# EAGLE design LuMini_3Inch (EAGLE 9.1.0)
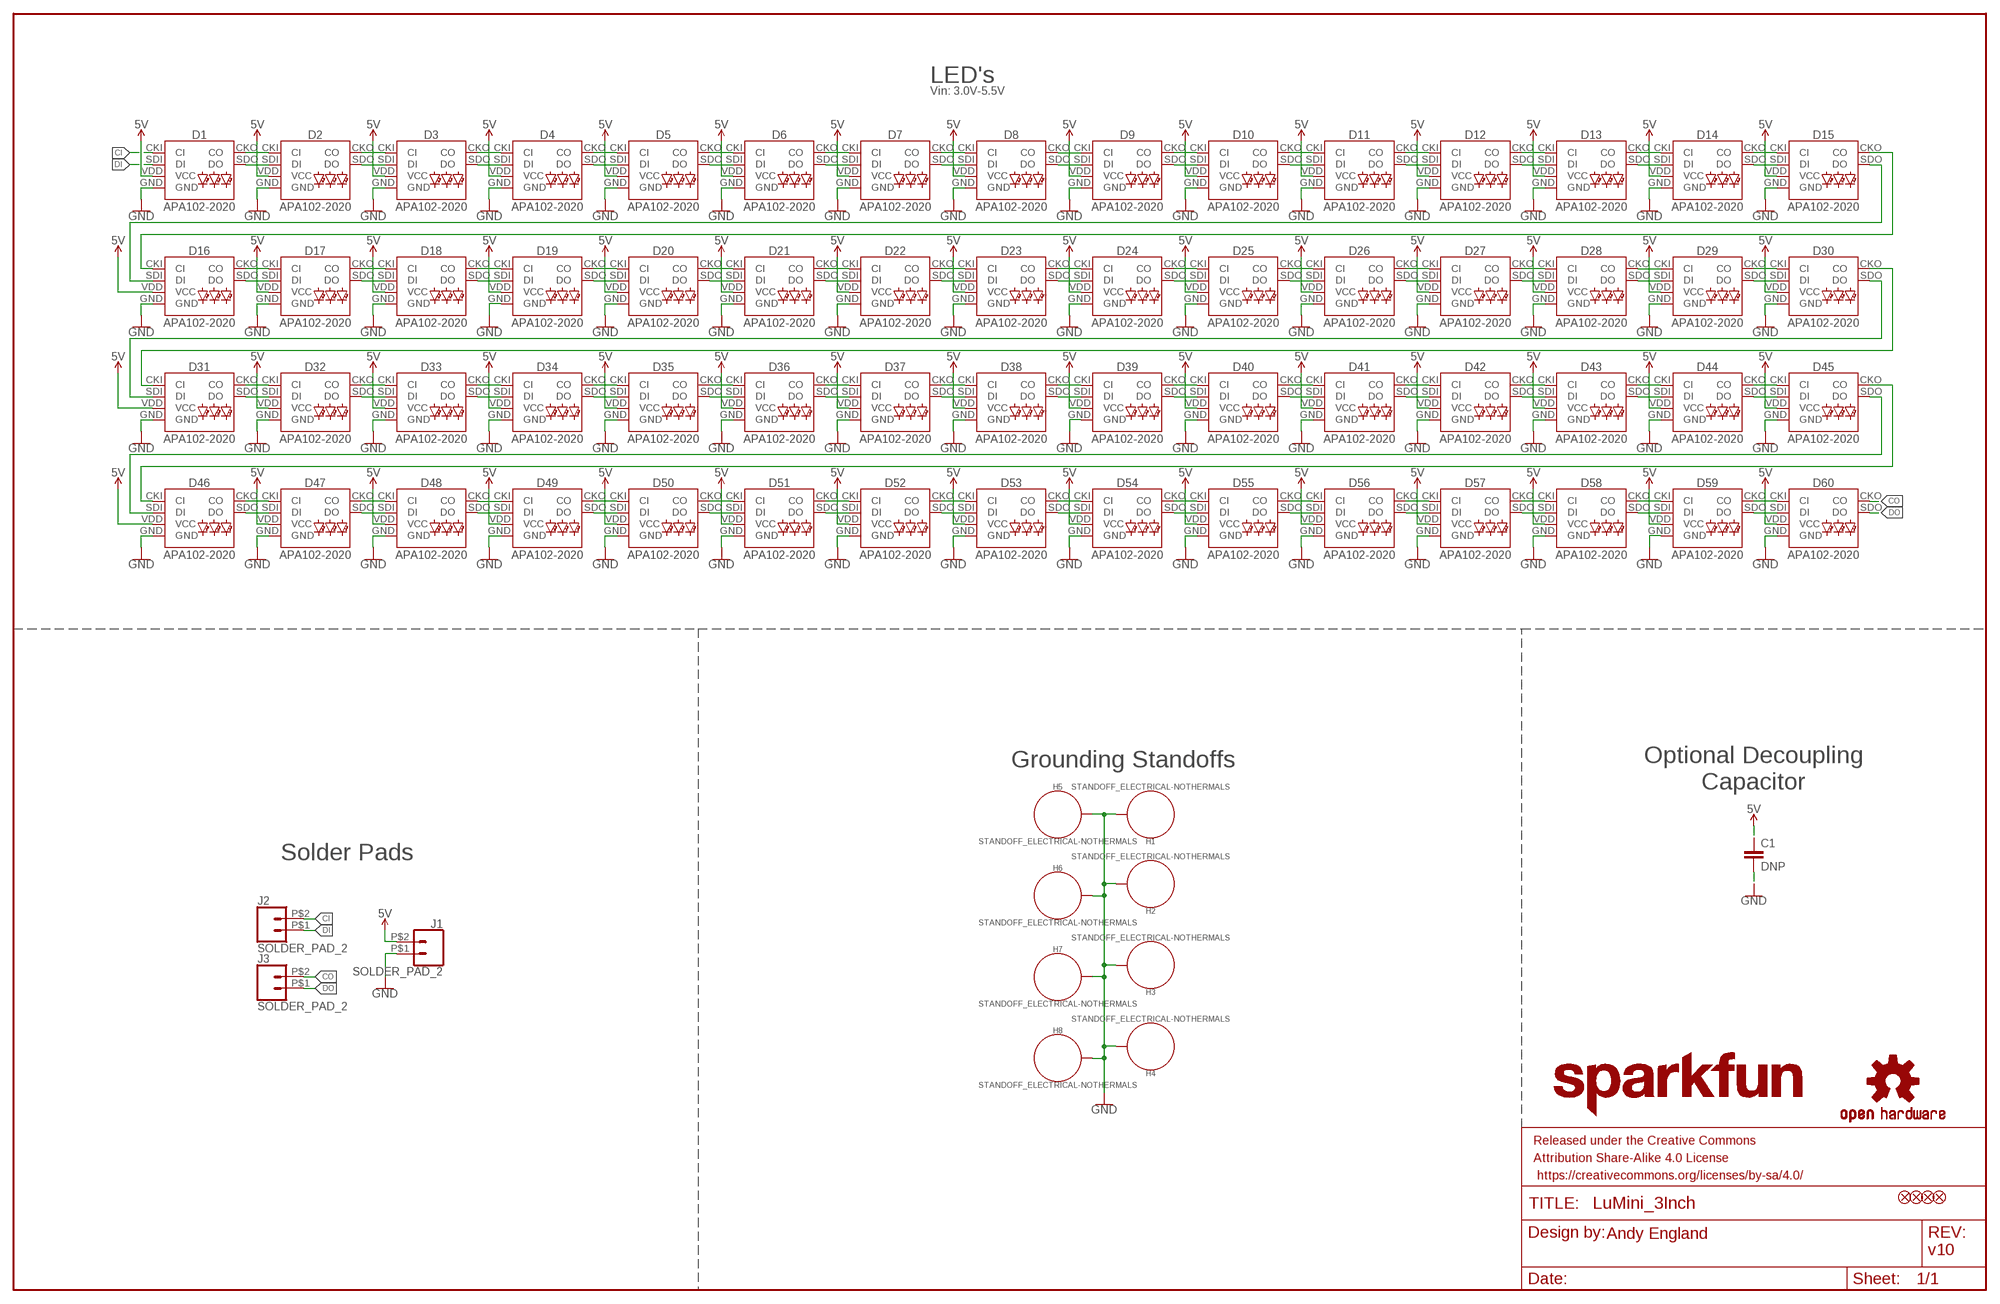
[diagram p0: schematic, sheet 1]

## Parts
C1  DNP  4.7UF-1206-16V-(+80/-20%)  [1206]
D1  APA102-2020  [APA102-2020]
D2  APA102-2020  [APA102-2020]
D3  APA102-2020  [APA102-2020]
D4  APA102-2020  [APA102-2020]
D5  APA102-2020  [APA102-2020]
D6  APA102-2020  [APA102-2020]
D7  APA102-2020  [APA102-2020]
D8  APA102-2020  [APA102-2020]
D9  APA102-2020  [APA102-2020]
D10  APA102-2020  [APA102-2020]
D11  APA102-2020  [APA102-2020]
D12  APA102-2020  [APA102-2020]
D13  APA102-2020  [APA102-2020]
D14  APA102-2020  [APA102-2020]
D15  APA102-2020  [APA102-2020]
D16  APA102-2020  [APA102-2020]
D17  APA102-2020  [APA102-2020]
D18  APA102-2020  [APA102-2020]
D19  APA102-2020  [APA102-2020]
D20  APA102-2020  [APA102-2020]
D21  APA102-2020  [APA102-2020]
D22  APA102-2020  [APA102-2020]
D23  APA102-2020  [APA102-2020]
D24  APA102-2020  [APA102-2020]
D25  APA102-2020  [APA102-2020]
D26  APA102-2020  [APA102-2020]
D27  APA102-2020  [APA102-2020]
D28  APA102-2020  [APA102-2020]
D29  APA102-2020  [APA102-2020]
D30  APA102-2020  [APA102-2020]
D31  APA102-2020  [APA102-2020]
D32  APA102-2020  [APA102-2020]
D33  APA102-2020  [APA102-2020]
D34  APA102-2020  [APA102-2020]
D35  APA102-2020  [APA102-2020]
D36  APA102-2020  [APA102-2020]
D37  APA102-2020  [APA102-2020]
D38  APA102-2020  [APA102-2020]
D39  APA102-2020  [APA102-2020]
D40  APA102-2020  [APA102-2020]
D41  APA102-2020  [APA102-2020]
D42  APA102-2020  [APA102-2020]
D43  APA102-2020  [APA102-2020]
D44  APA102-2020  [APA102-2020]
D45  APA102-2020  [APA102-2020]
D46  APA102-2020  [APA102-2020]
D47  APA102-2020  [APA102-2020]
D48  APA102-2020  [APA102-2020]
D49  APA102-2020  [APA102-2020]
D50  APA102-2020  [APA102-2020]
D51  APA102-2020  [APA102-2020]
D52  APA102-2020  [APA102-2020]
D53  APA102-2020  [APA102-2020]
D54  APA102-2020  [APA102-2020]
D55  APA102-2020  [APA102-2020]
D56  APA102-2020  [APA102-2020]
D57  APA102-2020  [APA102-2020]
D58  APA102-2020  [APA102-2020]
D59  APA102-2020  [APA102-2020]
D60  APA102-2020  [APA102-2020]
FD1  FIDUCIALUFIDUCIAL  [FIDUCIAL-MICRO]
FD2  FIDUCIALUFIDUCIAL  [FIDUCIAL-MICRO]
FD3  FIDUCIALUFIDUCIAL  [FIDUCIAL-MICRO]
FD4  FIDUCIALUFIDUCIAL  [FIDUCIAL-MICRO]
FRAME1  FRAME-LEDGER  [CREATIVE_COMMONS]
H1  STANDOFF_ELECTRICAL-NOTHERMALS  [STANDOFF-ELECTRICAL-NOTHERMALS]
H2  STANDOFF_ELECTRICAL-NOTHERMALS  [STANDOFF-ELECTRICAL-NOTHERMALS]
H3  STANDOFF_ELECTRICAL-NOTHERMALS  [STANDOFF-ELECTRICAL-NOTHERMALS]
H4  STANDOFF_ELECTRICAL-NOTHERMALS  [STANDOFF-ELECTRICAL-NOTHERMALS]
H5  STANDOFF_ELECTRICAL-NOTHERMALS  [STANDOFF-ELECTRICAL-NOTHERMALS]
H6  STANDOFF_ELECTRICAL-NOTHERMALS  [STANDOFF-ELECTRICAL-NOTHERMALS]
H7  STANDOFF_ELECTRICAL-NOTHERMALS  [STANDOFF-ELECTRICAL-NOTHERMALS]
H8  STANDOFF_ELECTRICAL-NOTHERMALS  [STANDOFF-ELECTRICAL-NOTHERMALS]
J1  SOLDER_PAD_2  [SOLDER_PAD_2]
J2  SOLDER_PAD_2  [SOLDER_PAD_2]
J3  SOLDER_PAD_2  [SOLDER_PAD_2]
LOGO1  OSHW-LOGOS  [OSHW-LOGO-S]
LOGO2  SFE_LOGO_NAME.1_INCH  [SFE_LOGO_NAME_.1]

## Nets
5V: C1.1 D1.VDD(VCC) D2.VDD(VCC) D3.VDD(VCC) D4.VDD(VCC) D5.VDD(VCC) D6.VDD(VCC) D7.VDD(VCC) D8.VDD(VCC) D9.VDD(VCC) D10.VDD(VCC) D11.VDD(VCC) D12.VDD(VCC) D13.VDD(VCC) D14.VDD(VCC) D15.VDD(VCC) D16.VDD(VCC) D17.VDD(VCC) D18.VDD(VCC) D19.VDD(VCC) D20.VDD(VCC) D21.VDD(VCC) D22.VDD(VCC) D23.VDD(VCC) D24.VDD(VCC) D25.VDD(VCC) D26.VDD(VCC) D27.VDD(VCC) D28.VDD(VCC) D29.VDD(VCC) D30.VDD(VCC) D31.VDD(VCC) D32.VDD(VCC) D33.VDD(VCC) D34.VDD(VCC) D35.VDD(VCC) D36.VDD(VCC) D37.VDD(VCC) D38.VDD(VCC) D39.VDD(VCC) D40.VDD(VCC) D41.VDD(VCC) D42.VDD(VCC) D43.VDD(VCC) D44.VDD(VCC) D45.VDD(VCC) D46.VDD(VCC) D47.VDD(VCC) D48.VDD(VCC) D49.VDD(VCC) D50.VDD(VCC) D51.VDD(VCC) D52.VDD(VCC) D53.VDD(VCC) D54.VDD(VCC) D55.VDD(VCC) D56.VDD(VCC) D57.VDD(VCC) D58.VDD(VCC) D59.VDD(VCC) D60.VDD(VCC) J1.P$2
CI: D1.CKI(CI) J2.P$2
CO: D60.CKO(CO) J3.P$2
DI: D1.SDI(DI) J2.P$1
DO: D60.SDO(DO) J3.P$1
GND: C1.2 D1.GND D2.GND D3.GND D4.GND D5.GND D6.GND D7.GND D8.GND D9.GND D10.GND D11.GND D12.GND D13.GND D14.GND D15.GND D16.GND D17.GND D18.GND D19.GND D20.GND D21.GND D22.GND D23.GND D24.GND D25.GND D26.GND D27.GND D28.GND D29.GND D30.GND D31.GND D32.GND D33.GND D34.GND D35.GND D36.GND D37.GND D38.GND D39.GND D40.GND D41.GND D42.GND D43.GND D44.GND D45.GND D46.GND D47.GND D48.GND D49.GND D50.GND D51.GND D52.GND D53.GND D54.GND D55.GND D56.GND D57.GND D58.GND D59.GND D60.GND H1.P1 H2.P1 H3.P1 H4.P1 H5.P1 H6.P1 H7.P1 H8.P1 J1.P$1
N$1: D4.CKO(CO) D5.CKI(CI)
N$4: D1.CKO(CO) D2.CKI(CI)
N$5: D1.SDO(DO) D2.SDI(DI)
N$6: D2.CKO(CO) D3.CKI(CI)
N$7: D2.SDO(DO) D3.SDI(DI)
N$8: D3.CKO(CO) D4.CKI(CI)
N$9: D3.SDO(DO) D4.SDI(DI)
N$10: D4.SDO(DO) D5.SDI(DI)
N$11: D5.CKO(CO) D6.CKI(CI)
N$12: D5.SDO(DO) D6.SDI(DI)
N$13: D6.CKO(CO) D7.CKI(CI)
N$14: D6.SDO(DO) D7.SDI(DI)
N$15: D7.CKO(CO) D8.CKI(CI)
N$16: D7.SDO(DO) D8.SDI(DI)
N$17: D16.SDO(DO) D17.SDI(DI)
N$18: D20.SDO(DO) D21.SDI(DI)
N$19: D9.CKO(CO) D10.CKI(CI)
N$20: D9.SDO(DO) D10.SDI(DI)
N$21: D10.CKO(CO) D11.CKI(CI)
N$22: D10.SDO(DO) D11.SDI(DI)
N$23: D11.CKO(CO) D12.CKI(CI)
N$24: D11.SDO(DO) D12.SDI(DI)
N$25: D12.CKO(CO) D13.CKI(CI)
N$26: D12.SDO(DO) D13.SDI(DI)
N$27: D13.CKO(CO) D14.CKI(CI)
N$28: D13.SDO(DO) D14.SDI(DI)
N$29: D14.CKO(CO) D15.CKI(CI)
N$30: D14.SDO(DO) D15.SDI(DI)
N$31: D45.CKO(CO) D46.CKI(CI)
N$32: D30.CKO(CO) D31.CKI(CI)
N$33: D8.CKO(CO) D9.CKI(CI)
N$34: D8.SDO(DO) D9.SDI(DI)
N$35: D17.CKO(CO) D18.CKI(CI)
N$36: D17.SDO(DO) D18.SDI(DI)
N$37: D18.CKO(CO) D19.CKI(CI)
N$38: D18.SDO(DO) D19.SDI(DI)
N$39: D19.CKO(CO) D20.CKI(CI)
N$40: D19.SDO(DO) D20.SDI(DI)
N$41: D30.SDO(DO) D31.SDI(DI)
N$42: D15.CKO(CO) D16.CKI(CI)
N$43: D16.CKO(CO) D17.CKI(CI)
N$44: D21.CKO(CO) D22.CKI(CI)
N$45: D21.SDO(DO) D22.SDI(DI)
N$46: D22.CKO(CO) D23.CKI(CI)
N$47: D22.SDO(DO) D23.SDI(DI)
N$48: D23.CKO(CO) D24.CKI(CI)
N$49: D23.SDO(DO) D24.SDI(DI)
N$50: D24.CKO(CO) D25.CKI(CI)
N$51: D24.SDO(DO) D25.SDI(DI)
N$52: D25.CKO(CO) D26.CKI(CI)
N$53: D25.SDO(DO) D26.SDI(DI)
N$54: D26.CKO(CO) D27.CKI(CI)
N$55: D26.SDO(DO) D27.SDI(DI)
N$56: D27.CKO(CO) D28.CKI(CI)
N$57: D27.SDO(DO) D28.SDI(DI)
N$58: D29.CKO(CO) D30.CKI(CI)
N$59: D29.SDO(DO) D30.SDI(DI)
N$60: D15.SDO(DO) D16.SDI(DI)
N$61: D45.SDO(DO) D46.SDI(DI)
N$62: D31.CKO(CO) D32.CKI(CI)
N$63: D31.SDO(DO) D32.SDI(DI)
N$64: D32.CKO(CO) D33.CKI(CI)
N$65: D32.SDO(DO) D33.SDI(DI)
N$66: D33.CKO(CO) D34.CKI(CI)
N$67: D33.SDO(DO) D34.SDI(DI)
N$68: D34.CKO(CO) D35.CKI(CI)
N$69: D34.SDO(DO) D35.SDI(DI)
N$70: D35.CKO(CO) D36.CKI(CI)
N$71: D35.SDO(DO) D36.SDI(DI)
N$72: D37.CKO(CO) D38.CKI(CI)
N$73: D37.SDO(DO) D38.SDI(DI)
N$74: D38.SDO(DO) D39.SDI(DI)
N$75: D39.CKO(CO) D40.CKI(CI)
N$76: D39.SDO(DO) D40.SDI(DI)
N$77: D38.CKO(CO) D39.CKI(CI)
N$78: D28.CKO(CO) D29.CKI(CI)
N$79: D28.SDO(DO) D29.SDI(DI)
N$80: D36.SDO(DO) D37.SDI(DI)
N$81: D36.CKO(CO) D37.CKI(CI)
N$82: D40.CKO(CO) D41.CKI(CI)
N$83: D40.SDO(DO) D41.SDI(DI)
N$84: D41.CKO(CO) D42.CKI(CI)
N$85: D41.SDO(DO) D42.SDI(DI)
N$86: D42.CKO(CO) D43.CKI(CI)
N$87: D42.SDO(DO) D43.SDI(DI)
N$88: D43.CKO(CO) D44.CKI(CI)
N$89: D43.SDO(DO) D44.SDI(DI)
N$90: D44.CKO(CO) D45.CKI(CI)
N$91: D44.SDO(DO) D45.SDI(DI)
N$94: D46.CKO(CO) D47.CKI(CI)
N$95: D46.SDO(DO) D47.SDI(DI)
N$96: D47.CKO(CO) D48.CKI(CI)
N$97: D47.SDO(DO) D48.SDI(DI)
N$98: D49.CKO(CO) D50.CKI(CI)
N$99: D49.SDO(DO) D50.SDI(DI)
N$100: D50.CKO(CO) D51.CKI(CI)
N$101: D50.SDO(DO) D51.SDI(DI)
N$102: D51.CKO(CO) D52.CKI(CI)
N$103: D51.SDO(DO) D52.SDI(DI)
N$104: D52.CKO(CO) D53.CKI(CI)
N$105: D52.SDO(DO) D53.SDI(DI)
N$106: D53.CKO(CO) D54.CKI(CI)
N$107: D53.SDO(DO) D54.SDI(DI)
N$108: D54.CKO(CO) D55.CKI(CI)
N$109: D54.SDO(DO) D55.SDI(DI)
N$110: D55.CKO(CO) D56.CKI(CI)
N$111: D55.SDO(DO) D56.SDI(DI)
N$112: D57.CKO(CO) D58.CKI(CI)
N$113: D57.SDO(DO) D58.SDI(DI)
N$114: D58.SDO(DO) D59.SDI(DI)
N$115: D59.CKO(CO) D60.CKI(CI)
N$116: D59.SDO(DO) D60.SDI(DI)
N$117: D58.CKO(CO) D59.CKI(CI)
N$118: D48.CKO(CO) D49.CKI(CI)
N$119: D48.SDO(DO) D49.SDI(DI)
N$120: D56.SDO(DO) D57.SDI(DI)
N$121: D56.CKO(CO) D57.CKI(CI)
N$124: D20.CKO(CO) D21.CKI(CI)

## Notes on the sheet
- LED's
- Vin: 3.0V-5.5V
- Grounding Standoffs
- Optional Decoupling
  Capacitor
- Solder Pads
- Andy England
- v10

## Library data of the parts
C1 = SparkFun-Capacitors:4.7UF: 4.7µF ceramic capacitors A capacitor is a passive two-terminal electrical component used to store electrical energy temporarily in an electric field.; PROD_ID: CAP-10300; VALUE: 4.7uF
D1-D60 = SparkFun-LED:APA102: APA102 Addressable RGB LED Used in manufacturing of various products at SparkFun Packages: 5050 2020 SparkFun Products: SparkFun Lumenati Boards <https://www.sparkfun.com/categories/405>; PROD_ID: DIO-13883
FD1-FD4 = SparkFun-Aesthetics:FIDUCIAL: Fiducial Alignment Points Point-of-reference for pick-and-place machines and other optical instruments.
FRAME1 = SparkFun-Aesthetics:FRAME-LEDGER: Schematic Frame - Ledger Standard 11x14 US Ledger frame
H1-H8 = SparkFun-Hardware:STANDOFF_ELECTRICAL: Stand Off Drill holes with an electrical connection. For example, use these to ground your board to a chassis. Example SparkFun Products Screw - Phillips Head (1/4", 4-40, 10 pack) <https://www.sparkfun.com/products/10453> (PRT-10453) Screw - Phillips Head (1/2", 4-40, 10 pack) <https://www.sparkfun.com/products/10452> (PRT-10452) Screw - Phillips Head (3/4", 4-40, 10 pack) <https://www.sparkfun.com/products/10451> (PRT-10451) Screw - Phillips Head (1", 4-40, 10 pack) <https://www.sparkfun.com/products/10450> (PRT-10450)
J1-J3 = SparkFun-Connectors:SOLDER_PAD_2: Solder Pad for LuMini Rings
LOGO1 = SparkFun-Aesthetics:OSHW-LOGO: Open-Source Hardware (OSHW) Logo This logo indicates the piece of hardware it is found on incorporates a OSHW license and/or adheres to the definition of open source hardware found here: http://freedomdefined.org/OSHW
LOGO2 = SparkFun-Aesthetics:SFE_LOGO_NAME: SparkFun Font Logo This is the SparkFun name logo. The logo on the schematic will always be the same size; the package variant is the height of the flame part of the logo (or the height the flame would be, if it were drawn). Default layer for the logo on the board is tSilk.

## Board
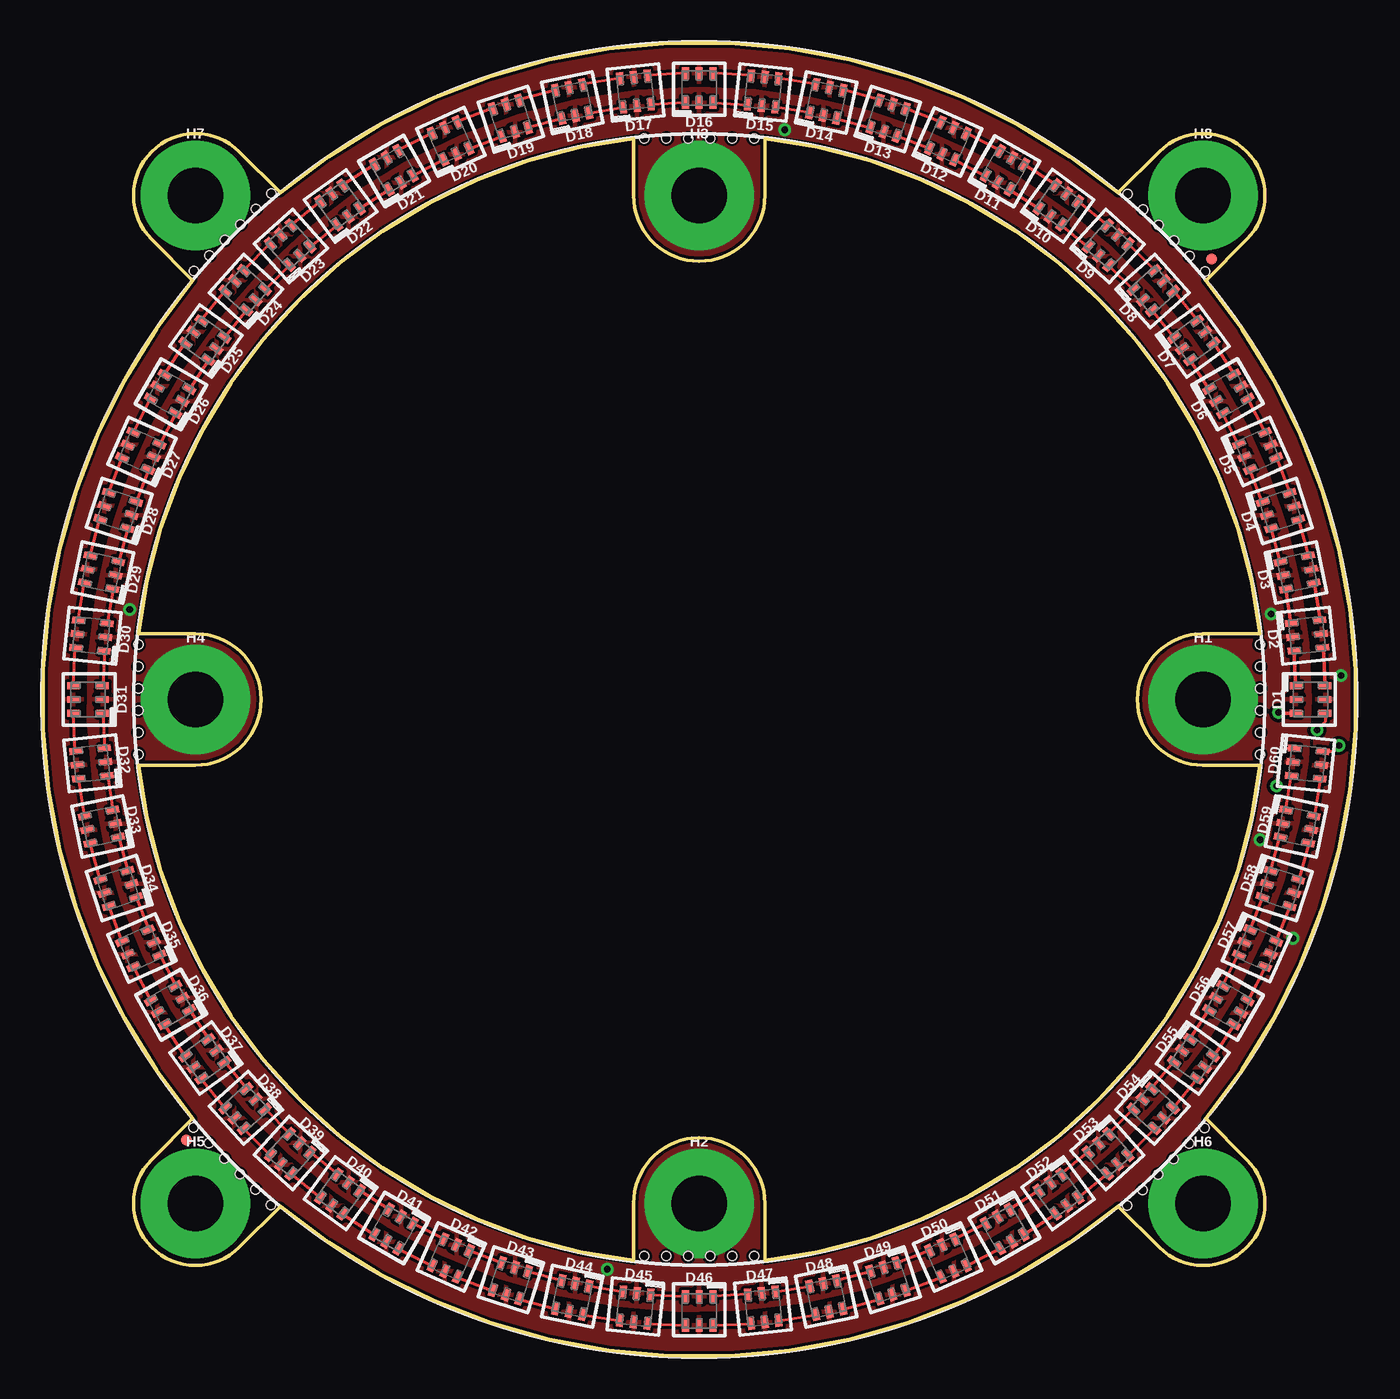
[diagram p1: board, top side]
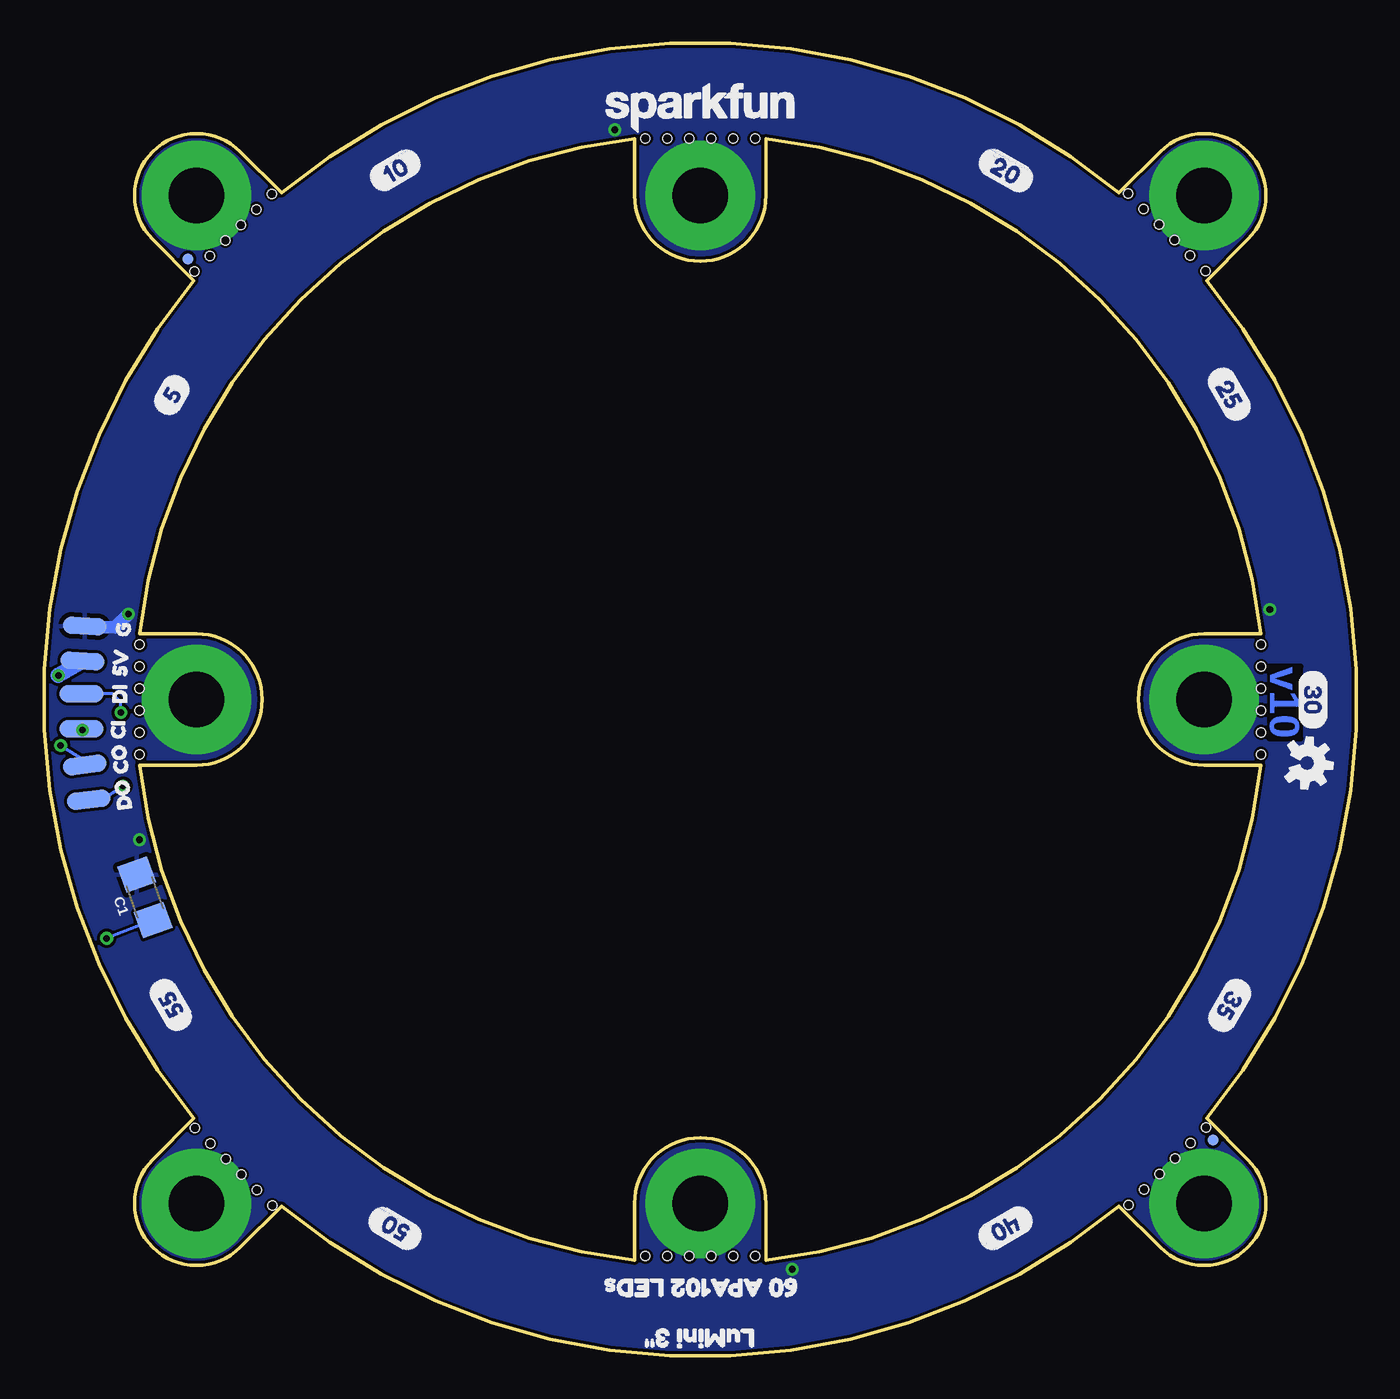
[diagram p2: board, bottom side, seen from below]

Size 76.08 x 76.08 mm. Coordinates in mm from the lower left corner, seen from the top.
Outline: 5.53,41.85 8.83,41.85 arc-90 12.64,38.04 arc-90 8.83,34.23 5.53,34.23 arc77 34.23,5.53 34.23,8.83 arc-90 38.04,12.64 arc-90 41.85,8.83 41.85,5.53 arc77 70.55,34.23 67.25,34.23 arc-90 63.44,38.04 arc-90 67.25,41.85 70.55,41.85 arc77 41.85,70.55 41.85,67.25 arc-90 38.04,63.44 arc-90 34.23,67.25 34.23,70.55 arc77 5.53,41.85
Outline: 8.68,62.32 6.29,64.71 arc-180 11.37,69.79 13.76,67.4 arc-79 62.32,67.4 64.71,69.79 arc-180 69.79,64.71 67.4,62.32 arc-79 67.4,13.76 69.79,11.37 arc-180 64.71,6.29 62.32,8.68 arc-79 13.76,8.68 11.37,6.29 arc-180 6.29,11.37 8.68,13.76 arc-79 8.68,62.32
Copper layers (1*16): Top 0.035mm / dielectric 1.5mm / Bottom 0.035mm
Design rules "SparkFun-2-layer-TIGHT": minimum track width 7mil, minimum drill 15mil, track to track 7mil, track to pad 7mil, pad to pad 7mil, via to via 7mil, smd to smd 7mil, copper to edge 7mil, drill to drill 7mil, minimum pad ring 7mil, minimum via ring 7mil, stop-mask expansion 4mil, vias tented up to drill 25mil, thermal gap 10mil
Holes 0.51 mm at 5.53,38.68 5.53,39.95 5.53,37.41 5.53,36.14 5.53,34.87 5.53,41.22 38.68,5.78 39.95,5.78 37.41,5.78 36.14,5.78 34.87,5.78 41.22,5.78 70.55,37.41 70.55,36.14 70.55,38.68 70.55,39.95 70.55,41.22 70.55,34.87 38.68,70.55 39.95,70.55 37.41,70.55 36.14,70.55 34.87,70.55 41.22,70.55 10.51,11.43 9.61,12.32 11.41,10.53 12.31,9.63 13.2,8.73 8.71,13.22 64.66,10.51 63.76,9.61 65.55,11.41 66.45,12.31 67.35,13.2 62.86,8.71 65.57,64.66 66.47,63.76 64.67,65.55 63.78,66.45 62.88,67.35 67.37,62.86 11.43,65.57 12.32,66.47 10.53,64.67 9.63,63.78 8.73,62.88 13.22,67.37

### Footprints (pad centres in the part's own frame; a part is rotated, then mirrored left to right if it is on the bottom)
1206 = smd 1.6 x 1.8: 1 -1.4,0; 2 1.4,0
APA102-2020 = smd 0.4 x 0.7: CKI -0.8,-0.85; CKO 0.8,-0.85; GND 0,0.85; SDI -0.8,0.85; SDO 0.8,0.85; VDD 0,-0.85
FIDUCIAL-MICRO = smd 0.635 x 0.635: 1 0,0
STANDOFF-ELECTRICAL-NOTHERMALS = drill 3.2 pad 6.35: P1 0,0
SOLDER_PAD_2 = smd 1.016 x 2.54: P$1 -1.016,0; P$2 1.016,0

### Placement (x,y rotation side)
C1  70.23,26.57 110 bottom
D1  73.47,38.04 90 top
D2  73.28,41.75 96 top
D3  72.7,45.41 102 top
D4  71.74,48.98 108 top
D5  70.41,52.45 114 top
D6  68.72,55.76 120 top
D7  66.71,58.86 126 top
D8  64.37,61.75 132 top
D9  61.75,64.36 138 top
D10  58.87,66.71 144 top
D11  55.76,68.72 150 top
D12  52.45,70.41 156 top
D13  48.99,71.74 162 top
D14  45.41,72.7 168 top
D15  41.75,73.28 174 top
D16  38.04,73.48 180 top
D17  34.33,73.28 186 top
D18  30.67,72.7 192 top
D19  27.1,71.73 198 top
D20  23.62,70.42 204 top
D21  20.33,68.72 210 top
D22  17.21,66.7 216 top
D23  14.32,64.37 222 top
D24  11.71,61.76 228 top
D25  9.38,58.86 234 top
D26  7.36,55.76 240 top
D27  5.67,52.45 246 top
D28  4.35,48.99 252 top
D29  3.39,45.41 258 top
D30  2.8,41.75 264 top
D31  2.6,38.04 270 top
D32  2.8,34.34 276 top
D33  3.38,30.67 282 top
D34  4.35,27.09 288 top
D35  5.67,23.62 294 top
D36  7.36,20.33 300 top
D37  9.38,17.21 306 top
D38  11.71,14.33 312 top
D39  14.32,11.72 318 top
D40  17.21,9.37 324 top
D41  20.32,7.35 330 top
D42  23.63,5.67 336 top
D43  27.1,4.34 342 top
D44  30.67,3.38 348 top
D45  34.33,2.79 354 top
D46  38.04,2.61 0 top
D47  41.75,2.8 6 top
D48  45.4,3.38 12 top
D49  48.98,4.35 18 top
D50  52.46,5.67 24 top
D51  55.76,7.36 30 top
D52  58.87,9.37 36 top
D53  61.75,11.71 42 top
D54  64.36,14.33 48 top
D55  66.71,17.21 54 top
D56  68.72,20.32 60 top
D57  70.41,23.63 66 top
D58  71.73,27.09 72 top
D59  72.7,30.68 78 top
D60  73.29,34.33 84 top
FD1  8.32,12.51 0 top
FD2  8.32,12.51 90 bottom
FD3  67.76,63.57 0 top
FD4  67.76,63.57 0 bottom
FRAME1  20.26,-8.19 0 top  (outside the outline)
H1  67.25,38.04 0 top
H2  38.04,8.83 0 top
H3  38.04,67.25 0 top
H4  8.83,38.04 0 top
H5  8.83,8.83 0 top
H6  67.25,8.83 0 top
H7  8.83,67.25 0 top
H8  67.25,67.25 0 top
J1  73.79,41.28 266.4 bottom
J2  73.92,37.35 270 bottom
J3  73.61,33.24 97 bottom
LOGO1  2.86,34.36 264 bottom
LOGO2  38.04,72.33 0 bottom
U$1  [LUMINI_3#2]  33.98,1.02 180 bottom
U$2  [60_APA102_LEDS0]  31.5,3.94 180 bottom
U$3  [54]  69.41,54.42 60 bottom
U$4  [5V6]  71.76,38.68 86.4 bottom
U$5  [G4]  71.57,40.96 86.4 bottom
U$6  [105]  57.13,67.9 30 bottom
U$7  [DO3]  71.31,30.93 97 bottom
U$8  [CO1]  71.5,33.02 97 bottom
U$9  [CI6]  71.8,35.02 90 bottom
U$10  [DI4]  71.7,37.09 90 bottom
U$11  [207]  21.86,69.59 330 bottom
U$12  [258]  8.23,57.24 300 bottom
U$13  [309]  2.52,39.81 270 bottom
U$14  [3510]  6.49,21.78 240 bottom
U$15  [4011]  18.8,8.28 210 bottom
U$16  [5013]  54.09,6.43 150 bottom
U$17  [5514]  67.91,18.9 120 bottom
U$18  [ORDERING_INSTRUCTIONS]  -9.71,-11.24 0 top  (outside the outline)

### Tracks (layer width: path | path; a pad name or v marks a point on that pad's centre or on a via)
5V  (via drill 0.38)
  Bottom 0.178: C1.1 v72.46,24.2
  Bottom 0.889: v75.25,39.44 J1.P$2
  pour Top (isolate 0.178, rank 2): 38.04,76.14 arc-90 76.14,38.04 arc-270
CI  (via drill 0.38)
  Top 0.178: D1.CKI 74.32,36.74 v73.85,36.28
  Bottom 0.178: J2.P$2 v73.85,36.28
CO  (via drill 0.38)
  Top 0.178: v75.12,35.37 74.79,35.04 D60.CKO
  Bottom 0.178: v75.12,35.37 73.74,34.51 J3.P$2
DI  (via drill 0.38)
  Top 0.203: v71.63,37.28 71.67,37.24 D1.SDI
  Bottom 0.178: v71.63,37.28 71.63,37.9 72.1,38.37 J2.P$1
DO  (via drill 0.38)
  Top 0.178: v71.5,33.02 71.8,35.04 72.01,35.25 D60.SDO
  Bottom 0.178: v71.5,33.02 72.76,32.23 J3.P$1
GND  (via drill 0.38)
  Bottom 0.762: J1.P$1 71.95,42.23 v71.19,42.99
  other vias: 70.55,29.91 32.71,5.02 5.02,43.25 42.99,71.06
  pour Top (isolate 0.178): 38.04,73.47 arc-90 73.47,38.04 arc-270
  pour Bottom (isolate 0.178, rank 2): 38.04,76.14 arc90 -0.06,38.04 arc270
  pour Bottom: 62.3,67.38 64.71,69.79 arc-180 69.79,64.71 67.38,62.3
  pour Bottom: 8.7,62.3 6.29,64.71 arc-180 11.37,69.79 13.78,67.38
  pour Bottom: 13.78,8.7 11.37,6.29 arc-180 6.29,11.37 8.7,13.78
  pour Bottom: 67.38,13.78 69.79,11.37 arc-180 64.71,6.29 62.3,8.7
N$1
  Top 0.178: D4.CKO D5.CKI
N$4
  Top 0.203: D1.CKO D2.CKI
N$5
  Top 0.203: D1.SDO D2.SDI
N$6
  Top 0.203: D2.CKO D3.CKI
N$7
  Top 0.203: D2.SDO D3.SDI
N$8
  Top 0.178: D3.CKO D4.CKI
N$9
  Top 0.178: D4.SDI D3.SDO
N$10
  Top 0.178: D4.SDO D5.SDI
N$11
  Top 0.178: D5.CKO D6.CKI
N$12
  Top 0.178: D5.SDO D6.SDI
N$13
  Top 0.178: D6.CKO D7.CKI
N$14
  Top 0.178: D7.SDI D6.SDO
N$15
  Top 0.178: D7.CKO D8.CKI
N$16
  Top 0.178: D7.SDO D8.SDI
N$17
  Top 0.178: D16.SDO D17.SDI
N$18
  Top 0.178: D20.SDO D21.SDI
N$19
  Top 0.178: D9.CKO D10.CKI
N$20
  Top 0.178: D9.SDO D10.SDI
N$21
  Top 0.178: D10.CKO D11.CKI
N$22
  Top 0.178: D10.SDO D11.SDI
N$23
  Top 0.178: D11.CKO D12.CKI
N$24
  Top 0.178: D12.SDI D11.SDO
N$25
  Top 0.178: D13.CKI D12.CKO
N$26
  Top 0.178: D12.SDO D13.SDI
N$27
  Top 0.178: D13.CKO D14.CKI
N$28
  Top 0.178: D14.SDI D13.SDO
N$29
  Top 0.178: D14.CKO D15.CKI
N$30
  Top 0.178: D14.SDO D15.SDI
N$31
  Top 0.178: D45.CKO D46.CKI
N$32
  Top 0.178: D31.CKI D30.CKO
N$33
  Top 0.178: D8.CKO D9.CKI
N$34
  Top 0.178: D9.SDI D8.SDO
N$35
  Top 0.178: D17.CKO D18.CKI
N$36
  Top 0.178: D18.SDI D17.SDO
N$37
  Top 0.178: D18.CKO D19.CKI
N$38
  Top 0.178: D18.SDO D19.SDI
N$39
  Top 0.178: D19.CKO D20.CKI
N$40
  Top 0.178: D20.SDI D19.SDO
N$41
  Top 0.178: D30.SDO D31.SDI
N$42
  Top 0.178: D15.CKO D16.CKI
N$43
  Top 0.178: D16.CKO D17.CKI
N$44
  Top 0.178: D22.CKI D21.CKO
N$45
  Top 0.178: D21.SDO D22.SDI
N$46
  Top 0.178: D22.CKO D23.CKI
N$47
  Top 0.178: D22.SDO D23.SDI
N$48
  Top 0.178: D23.CKO D24.CKI
N$49
  Top 0.178: D23.SDO D24.SDI
N$50
  Top 0.178: D24.CKO D25.CKI
N$51
  Top 0.178: D24.SDO D25.SDI
N$52
  Top 0.178: D25.CKO D26.CKI
N$53
  Top 0.178: D25.SDO D26.SDI
N$54
  Top 0.178: D26.CKO D27.CKI
N$55
  Top 0.178: D26.SDO D27.SDI
N$56
  Top 0.178: D27.CKO D28.CKI
N$57
  Top 0.178: D27.SDO D28.SDI
N$58
  Top 0.178: D30.CKI D29.CKO
N$59
  Top 0.178: D29.SDO D30.SDI
N$60
  Top 0.178: D16.SDI D15.SDO
N$61
  Top 0.178: D45.SDO D46.SDI
N$62
  Top 0.178: D32.CKI D31.CKO
N$63
  Top 0.178: D31.SDO D32.SDI
N$64
  Top 0.178: D32.CKO D33.CKI
N$65
  Top 0.178: D32.SDO D33.SDI
N$66
  Top 0.178: D33.CKO D34.CKI
N$67
  Top 0.178: D33.SDO D34.SDI
N$68
  Top 0.178: D34.CKO D35.CKI
N$69
  Top 0.178: D34.SDO D35.SDI
N$70
  Top 0.178: D35.CKO D36.CKI
N$71
  Top 0.178: D35.SDO D36.SDI
N$72
  Top 0.178: D37.CKO D38.CKI
N$73
  Top 0.178: D37.SDO D38.SDI
N$74
  Top 0.178: D38.SDO D39.SDI
N$75
  Top 0.178: D39.CKO D40.CKI
N$76
  Top 0.178: D39.SDO D40.SDI
N$77
  Top 0.178: D38.CKO D39.CKI
N$78
  Top 0.178: D29.CKI D28.CKO
N$79
  Top 0.178: D28.SDO D29.SDI
N$80
  Top 0.178: D36.SDO D37.SDI
N$81
  Top 0.178: D36.CKO D37.CKI
N$82
  Top 0.178: D40.CKO D41.CKI
N$83
  Top 0.178: D40.SDO D41.SDI
N$84
  Top 0.178: D41.CKO D42.CKI
N$85
  Top 0.178: D41.SDO D42.SDI
N$86
  Top 0.178: D42.CKO D43.CKI
N$87
  Top 0.178: D42.SDO D43.SDI
N$88
  Top 0.178: D43.CKO D44.CKI
N$89
  Top 0.178: D43.SDO D44.SDI
N$90
  Top 0.178: D44.CKO D45.CKI
N$91
  Top 0.178: D44.SDO D45.SDI
N$94
  Top 0.178: D46.CKO D47.CKI
N$95
  Top 0.178: D47.SDI D46.SDO
N$96
  Top 0.178: D47.CKO D48.CKI
N$97
  Top 0.178: D47.SDO D48.SDI
N$98
  Top 0.178: D49.CKO D50.CKI
N$99
  Top 0.178: D49.SDO D50.SDI
N$100
  Top 0.178: D50.CKO D51.CKI
N$101
  Top 0.178: D50.SDO D51.SDI
N$102
  Top 0.178: D52.CKI D51.CKO
N$103
  Top 0.178: D51.SDO D52.SDI
N$104
  Top 0.178: D52.CKO D53.CKI
N$105
  Top 0.178: D52.SDO D53.SDI
N$106
  Top 0.178: D53.CKO D54.CKI
N$107
  Top 0.178: D53.SDO D54.SDI
N$108
  Top 0.178: D55.CKI D54.CKO
N$109
  Top 0.178: D54.SDO D55.SDI
N$110
  Top 0.178: D56.CKI D55.CKO
N$111
  Top 0.178: D55.SDO D56.SDI
N$112
  Top 0.178: D57.CKO D58.CKI
N$113
  Top 0.178: D58.SDI D57.SDO
N$114
  Top 0.178: D58.SDO D59.SDI
N$115
  Top 0.178: D60.CKI D59.CKO
N$116
  Top 0.178: D59.SDO D60.SDI
N$117
  Top 0.178: D59.CKI D58.CKO
N$118
  Top 0.178: D48.CKO D49.CKI
N$119
  Top 0.178: D48.SDO D49.SDI
N$120
  Top 0.178: D56.SDO D57.SDI
N$121
  Top 0.178: D57.CKI D56.CKO
N$124
  Top 0.178: D20.CKO D21.CKI

### Text on the board
Bottom: v10
tDocu: Andy England | Black PCB